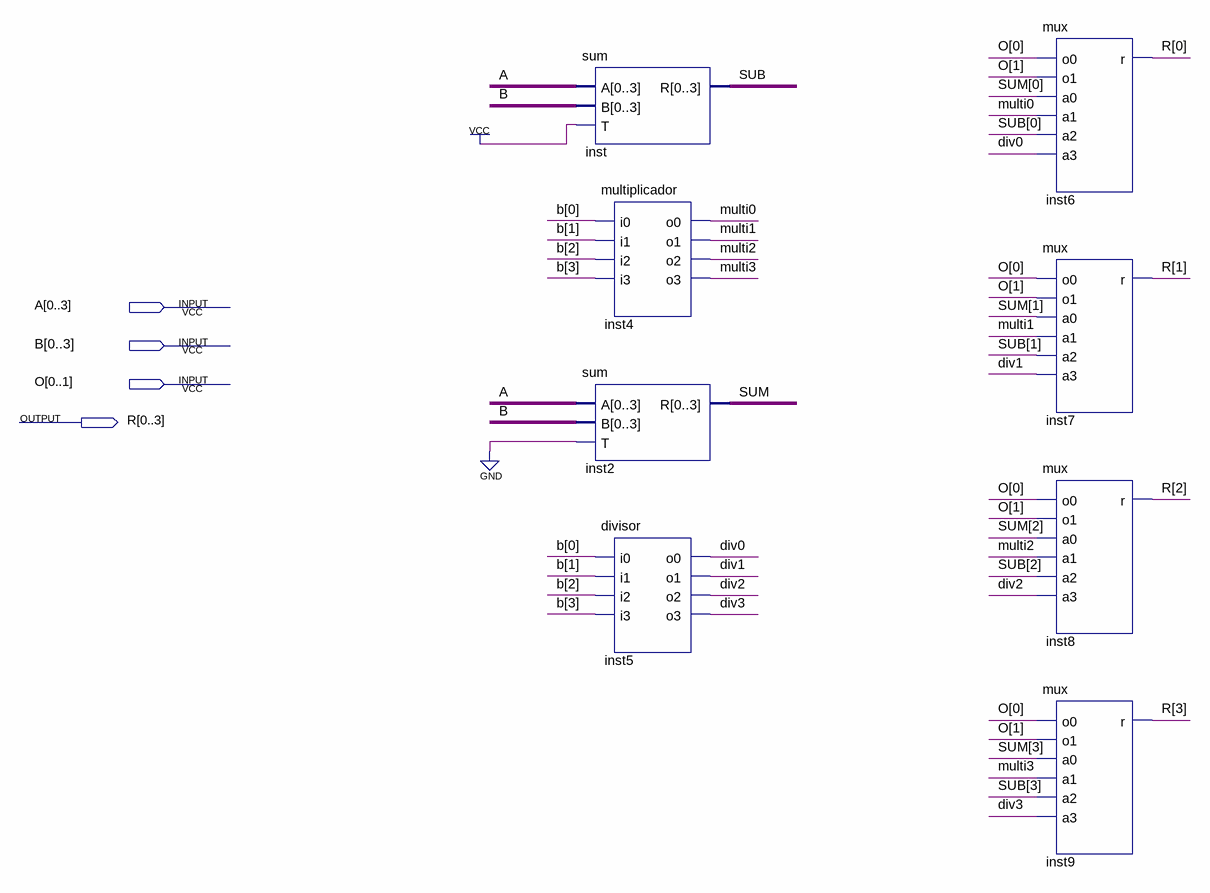
[diagram p0: schematic sheet]
// Quartus schematic ula.bdf as structural Verilog: 8 symbols, 4 pins
module ula (
  input  [0:3] A,
  input  [0:3] B,
  input  [0:1] O,
  output [0:3] R
);

  wire A_1bit, B_1bit, div0, div1, div2, div3, multi0, multi1, multi2, multi3, SUB_1bit, SUM_1bit;
  wire [3:0] SUB, SUM;

  sum inst (.A({4{A_1bit}}), .B({4{B_1bit}}), .T(1'b1), .R(SUB_1bit));
  multiplicador inst4 (.i0(B[0]), .i1(B[1]), .i2(B[2]), .i3(B[3]), .o0(multi0), .o1(multi1), .o2(multi2), .o3(multi3));
  sum inst2 (.A({4{A_1bit}}), .B({4{B_1bit}}), .T(1'b0), .R(SUM_1bit));
  divisor inst5 (.i0(B[0]), .i1(B[1]), .i2(B[2]), .i3(B[3]), .o0(div0), .o1(div1), .o2(div2), .o3(div3));
  mux inst6 (.o0(O[0]), .o1(O[1]), .a0(SUM[0]), .a1(multi0), .a2(SUB[0]), .a3(div0), .r(R[0]));
  mux inst7 (.o0(O[0]), .o1(O[1]), .a0(SUM[1]), .a1(multi1), .a2(SUB[1]), .a3(div1), .r(R[1]));
  mux inst8 (.o0(O[0]), .o1(O[1]), .a0(SUM[2]), .a1(multi2), .a2(SUB[2]), .a3(div2), .r(R[2]));
  mux inst9 (.o0(O[0]), .o1(O[1]), .a0(SUM[3]), .a1(multi3), .a2(SUB[3]), .a3(div3), .r(R[3]));
endmodule
